# Altium schematic sheet ADC_OLD.SchDoc: Set in Document Options » Parameters » Title
size A4; Author: Set in Document Options » Parameters » Author + Contact info
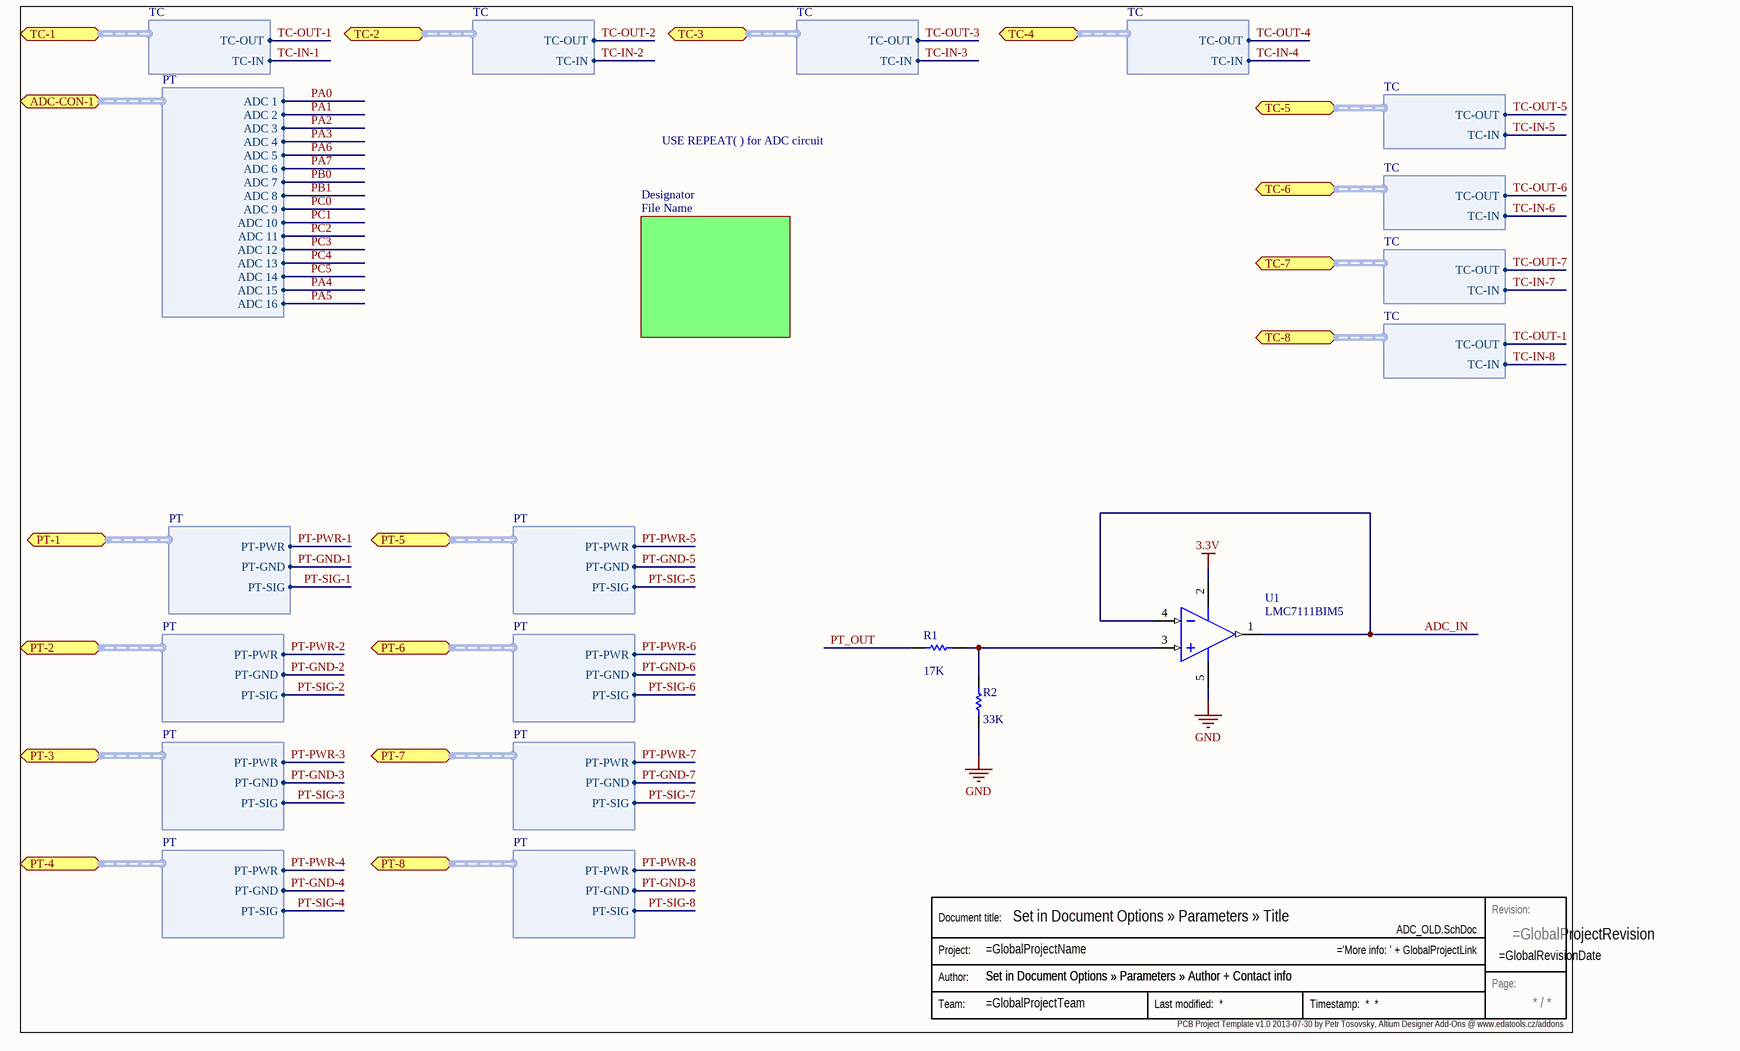
[diagram p0: ADC_OLD.SchDoc]

## Parts
R1  value 17K  [AXIAL-0.3]
R2  RES-33K: 33K  [AXIAL-0.3]
Stamp  Stamp  (value not drawn)  (graphical)
U1  LMC7111BIM5  [MF05A_N]

## Sub-sheets
Designator = File Name: no entries

## Ports
ADC-CON-1 (harness PT), PT-1 (harness PT), PT-2 (harness PT), PT-3 (harness PT), PT-4 (harness PT), PT-5 (harness PT), PT-6 (harness PT), PT-7 (harness PT), PT-8 (harness PT), TC-1 (harness TC), TC-2 (harness TC), TC-3 (harness TC), TC-4 (harness TC), TC-5 (harness TC), TC-6 (harness TC), TC-7 (harness TC), TC-8 (harness TC)

## Harnesses
PT: PT-SIG, PT-GND, PT-PWR
TC: TC-IN, TC-OUT
PT: ADC 1, ADC 2, ADC 3, ADC 4, ADC 5, ADC 6, ADC 7, ADC 8, ADC 9, ADC 10, ADC 11, ADC 12, ADC 13, ADC 14, ADC 15, ADC 16

## Nets
3.3V: U1.2(V+)
GND: R2.1 U1.5(V-)
ADC_IN: U1.1(OUT) U1.4(IN-)
PA0: port ADC-CON-1.ADC 1
PA1: port ADC-CON-1.ADC 2
PA2: port ADC-CON-1.ADC 3
PA3: port ADC-CON-1.ADC 4
PA4: port ADC-CON-1.ADC 15
PA5: port ADC-CON-1.ADC 16
PA6: port ADC-CON-1.ADC 5
PA7: port ADC-CON-1.ADC 6
PB0: port ADC-CON-1.ADC 7
PB1: port ADC-CON-1.ADC 8
PC0: port ADC-CON-1.ADC 9
PC1: port ADC-CON-1.ADC 10
PC2: port ADC-CON-1.ADC 11
PC3: port ADC-CON-1.ADC 12
PC4: port ADC-CON-1.ADC 13
PC5: port ADC-CON-1.ADC 14
PT-GND-1: port PT-1.PT-GND
PT-GND-2: port PT-2.PT-GND
PT-GND-3: port PT-3.PT-GND
PT-GND-4: port PT-4.PT-GND
PT-GND-5: port PT-5.PT-GND
PT-GND-6: port PT-6.PT-GND
PT-GND-7: port PT-7.PT-GND
PT-GND-8: port PT-8.PT-GND
PT-PWR-1: port PT-1.PT-PWR
PT-PWR-2: port PT-2.PT-PWR
PT-PWR-3: port PT-3.PT-PWR
PT-PWR-4: port PT-4.PT-PWR
PT-PWR-5: port PT-5.PT-PWR
PT-PWR-6: port PT-6.PT-PWR
PT-PWR-7: port PT-7.PT-PWR
PT-PWR-8: port PT-8.PT-PWR
PT-SIG-1: port PT-1.PT-SIG
PT-SIG-2: port PT-2.PT-SIG
PT-SIG-3: port PT-3.PT-SIG
PT-SIG-4: port PT-4.PT-SIG
PT-SIG-5: port PT-5.PT-SIG
PT-SIG-6: port PT-6.PT-SIG
PT-SIG-7: port PT-7.PT-SIG
PT-SIG-8: port PT-8.PT-SIG
PT_OUT: R1.1
TC-IN-1: port TC-1.TC-IN
TC-IN-2: port TC-2.TC-IN
TC-IN-3: port TC-3.TC-IN
TC-IN-4: port TC-4.TC-IN
TC-IN-5: port TC-5.TC-IN
TC-IN-6: port TC-6.TC-IN
TC-IN-7: port TC-7.TC-IN
TC-IN-8: port TC-8.TC-IN
TC-OUT-1: port TC-1.TC-OUT, port TC-8.TC-OUT
TC-OUT-2: port TC-2.TC-OUT
TC-OUT-3: port TC-3.TC-OUT
TC-OUT-4: port TC-4.TC-OUT
TC-OUT-5: port TC-5.TC-OUT
TC-OUT-6: port TC-6.TC-OUT
TC-OUT-7: port TC-7.TC-OUT
NetR1_2: R1.2 R2.2 U1.3(IN+)

## Notes on the sheet
- USE REPEAT( ) for ADC circuit
- PCB Project Template v1.0 2013-07-30 by Petr Tosovsky, Altium Designer Add-Ons @ www.edatools.cz/addons <http://www.edatools.cz/addons>
- (in symbol Stamp) Revision:; Document title:; Project:; Author:; Page:; Team:

## Library data of the parts
R1 R2 = Res1: Resistor; Published: 8-Jun-2000; LatestRevisionDate: 17-Jul-2002; LatestRevisionNote: Re-released for DXP Platform.; PackageReference: AXIAL-0.3; Publisher: Altium Limited; PackageDescription: Axial Device, Thru-Hole; 2 Leads; 0.3 in Pin Spacing
U1 = LMC7111BIM5: Tiny CMOS Operational Amplifier with Rail-to-Rail Input and Output, 5-pin SOT-23; Manufacturer: National Semiconductor; PackageTopMarking: A01B*XTT; PowerWise: N; CompType: Amplifiers; High-Reliability: Y; DatasheetVersion: Jun-2006; PackageVersion: revD, Aug-2008; PackageReference: MF05A; PackageDescription: Molded SOT-23, .115 x .063 x .040 in Body, 5 Lead, .0375 in Pitch; PartNumber: LMC7111BIM5; RoHS: N; PinCount: 5; ComponentLink1Description: Manufacturer URL; ComponentLink1URL: http://www.national.com/; ComponentLink2Description: LMC7111 Datasheet; ComponentLink2URL: http://www.national.com/ds/LM/LMC7111.pdf; ComponentLink3Description: LMC7111 Web Page; ComponentLink3URL: http://www.national.com/pf/LM/LMC7111.html; ComponentLink4Description: MF05A Package Page; ComponentLink4URL: http://www.national.com/packaging/folders/mf05a.html